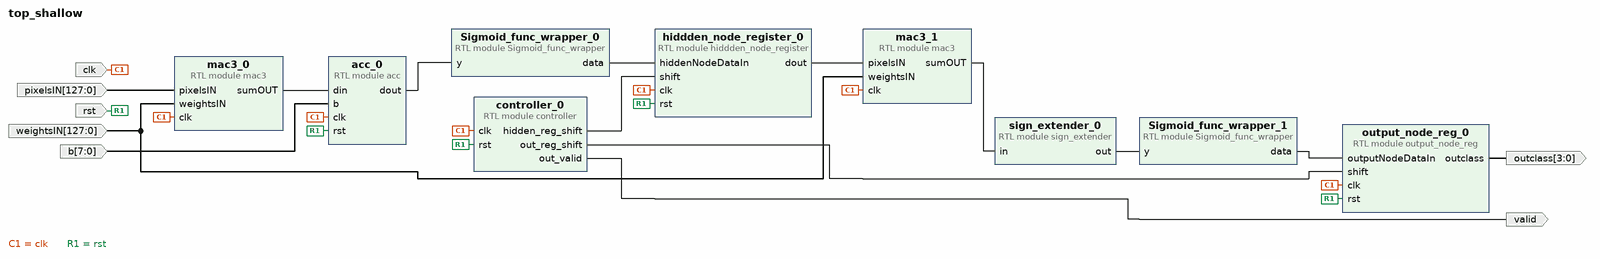
[diagram p0: block diagram of the top level]
# Vivado block design top_shallow, xc7a35tcpg236-1, Vivado 2022.2
create_bd_design top_shallow

create_bd_port -dir O valid
create_bd_port -dir O -from 3 -to 0 outclass
create_bd_port -dir I -type clk clk
create_bd_port -dir I -from 7 -to 0 b
create_bd_port -dir I -from 127 -to 0 pixelsIN
create_bd_port -dir I -from 127 -to 0 weightsIN
create_bd_port -dir I -type rst rst

create_bd_cell -type module -reference Sigmoid_func_wrapper Sigmoid_func_wrapper_0
create_bd_cell -type module -reference mac3 mac3_0
create_bd_cell -type module -reference acc acc_0
create_bd_cell -type module -reference mac3 mac3_1
create_bd_cell -type module -reference Sigmoid_func_wrapper Sigmoid_func_wrapper_1
create_bd_cell -type module -reference sign_extender sign_extender_0
create_bd_cell -type module -reference controller controller_0
create_bd_cell -type module -reference hiddden_node_register hiddden_node_register_0
create_bd_cell -type module -reference output_node_reg output_node_reg_0

# ---- connections ----

connect_bd_net [get_bd_pins Sigmoid_func_wrapper_0/data] [get_bd_pins hiddden_node_register_0/hiddenNodeDataIn]
connect_bd_net [get_bd_pins Sigmoid_func_wrapper_1/data] [get_bd_pins output_node_reg_0/outputNodeDataIn]
connect_bd_net [get_bd_pins acc_0/dout] [get_bd_pins Sigmoid_func_wrapper_0/y]
connect_bd_net -net b_0_1 [get_bd_ports b] [get_bd_pins acc_0/b]
connect_bd_net -net clk_0_1 [get_bd_ports clk] \
  [get_bd_pins mac3_0/clk] [get_bd_pins acc_0/clk] [get_bd_pins mac3_1/clk] [get_bd_pins controller_0/clk] \
  [get_bd_pins hiddden_node_register_0/clk] [get_bd_pins output_node_reg_0/clk]
connect_bd_net [get_bd_pins controller_0/hidden_reg_shift] [get_bd_pins hiddden_node_register_0/shift]
connect_bd_net [get_bd_pins controller_0/out_reg_shift] [get_bd_pins output_node_reg_0/shift]
connect_bd_net [get_bd_pins controller_0/out_valid] [get_bd_ports valid]
connect_bd_net [get_bd_pins hiddden_node_register_0/dout] [get_bd_pins mac3_1/pixelsIN]
connect_bd_net [get_bd_pins mac3_0/sumOUT] [get_bd_pins acc_0/din]
connect_bd_net [get_bd_pins mac3_1/sumOUT] [get_bd_pins sign_extender_0/in]
connect_bd_net [get_bd_pins output_node_reg_0/outclass] [get_bd_ports outclass]
connect_bd_net -net pixelsIN_0_1 [get_bd_ports pixelsIN] [get_bd_pins mac3_0/pixelsIN]
connect_bd_net -net rst_0_1 [get_bd_ports rst] \
  [get_bd_pins acc_0/rst] [get_bd_pins controller_0/rst] [get_bd_pins hiddden_node_register_0/rst] \
  [get_bd_pins output_node_reg_0/rst]
connect_bd_net [get_bd_pins sign_extender_0/out] [get_bd_pins Sigmoid_func_wrapper_1/y]
connect_bd_net -net weightsIN_0_1 [get_bd_ports weightsIN] [get_bd_pins mac3_0/weightsIN] [get_bd_pins mac3_1/weightsIN]

validate_bd_design
save_bd_design
